# Altium schematic sheet PULSE.SchDoc
size A4
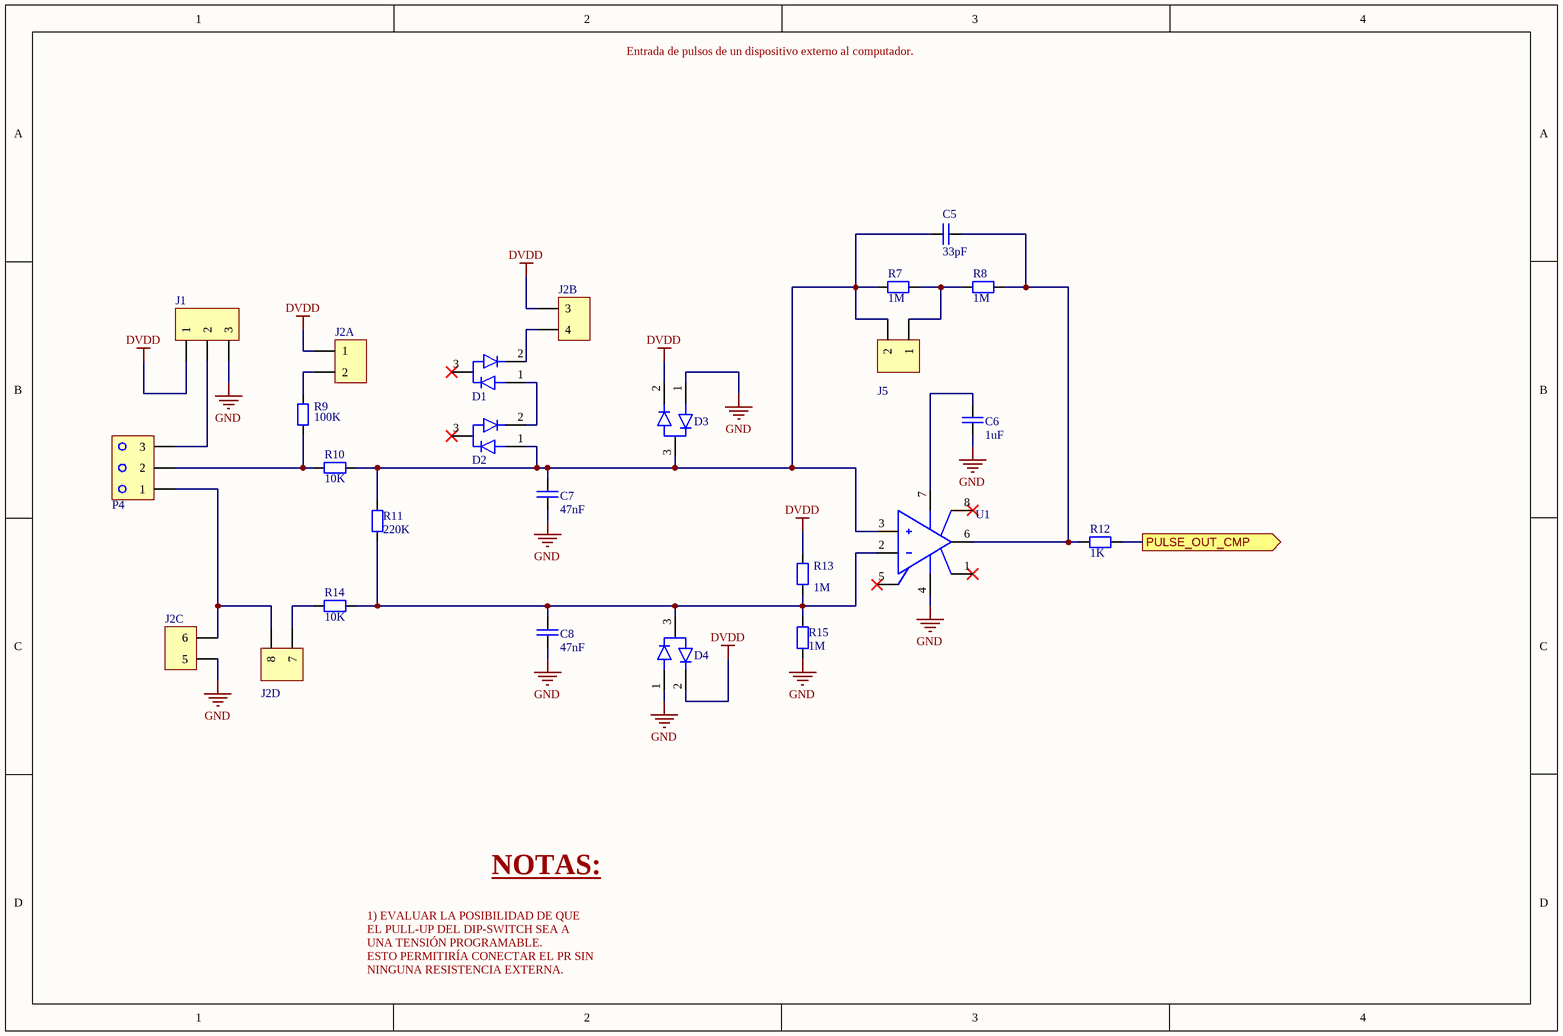
[diagram p0: PULSE.SchDoc]

## Parts
C5  33pF  [CAP_SM0805_YAGEOCC2_N]
C6  1uF  [CAP_SM0805_YAGEOCC2_N]
C7  47nF  [CAP_SM0805_YAGEOCC2_N]
C8  47nF  [CAP_SM0805_YAGEOCC2_N]
D1  BAV23S  [BAV23S]  (value not drawn)
D2  BAV23S  [BAV23S]  (value not drawn)
D3  BAV23S  [BAV23S]  (value not drawn)
D4  BAV23S  [BAV23S]  (value not drawn)
J1  (no value)  [HEADER PIN 1X3]
J2  Usar equivalente  [HEADER PIN 2X4]  (value not drawn)  (parts A,B,C,D of 4)
J5  Usar Equivalente  [HEADER PIN 1X2]  (value not drawn)
P4  WJ15EDGVC-3.81-3P  [HEADER PLUG 3]  (value not drawn)
R7  1M  [RES_SM0805_YAGEORC_N]
R8  1M  [RES_SM0805_YAGEORC_N]
R9  100K  [RES_SM0805_YAGEORC_N]
R10  10K  [RES_SM0805_YAGEORC_N]
R11  220K  [RES_SM0805_YAGEORC_N]
R12  1K  [RES_SM0805_YAGEORC_N]
R13  1M  [RES_SM0805_YAGEORC_N]
R14  10K  [RES_SM0805_YAGEORC_N]
R15  1M  [RES_SM0805_YAGEORC_N]
U1  MCP6541  [MCP6541-E/SN]  (value not drawn)

## Ports
PULSE_OUT_CMP (out)

## Nets
DVDD: D3.2 D4.2 J1.1 J2.1 J2.3 R13.2
GND: C6.2 C7.2 C8.2 D3.1 D4.1 J1.3 J2.5 R15.1 U1.4(V-)
PULSE_OUT_CMP: R12.2 ; port PULSE_OUT_CMP
NetC5_1: C5.1 C7.1 D2.1 D3.3 J5.2 R7.1 R10.2 R11.2 U1.3(IN+)
NetC5_2: C5.2 R8.2 R12.1 U1.6(OUT)
NetC6_1: C6.1 U1.7(V+)
NetC8_1: C8.1 D4.3 R11.1 R13.1 R14.2 R15.2 U1.2(IN-)
NetD1_1: D1.1 D2.2
NetD1_2: D1.2 J2.4
NetJ1_2: J1.2 P4.3
NetJ2_2: J2.2 R9.2
NetJ2_6: J2.6 J2.8 P4.1
NetJ2_7: J2.7 R14.1
NetJ5_1: J5.1 R7.2 R8.1
NetP4_2: P4.2 R9.1 R10.1

Not connected (* = marked no-connect by the designer): D1 3*; D2 3*; U1 1(OS_NUL)* 5(OS_NUL)* 8(TAB)*

## Notes on the sheet
- Entrada de pulsos de un dispositivo externo al computador.
- NOTAS:
- 1) EVALUAR LA POSIBILIDAD DE QUE EL PULL-UP DEL DIP-SWITCH SEA A UNA TENSIÓN PROGRAMABLE.
  ESTO PERMITIRÍA CONECTAR EL PR SIN NINGUNA RESISTENCIA EXTERNA.
- Title:
- Size: A4
- Date:
- FMC-320U MODEL A
- Sheet:
- Time:
- Of:
- Version:
- Revision:
- Release:
- 1
- 0
- FLOWMEET SRL
- File

## Library data of the parts
C5 = CC0805JRNPO9BN330: CAP 33pF SM0805 NPO 50V YAGEO CC2; Tolerance (%): 5; Voltage Rating (Volts): 50; Category: Capacitor; Manufacturer: Yageo; Manufacturer Part Number: CC0805JRNPO9BN330; Package: 0805; Value: 33pF; Supplier Part Number 1: 1362559; Supplier 1: Farnell; ComponentLink1URL: http://www.yageo.com; ComponentLink1Description: Manufacturer Website; Supplier 2: Digi-Key; Supplier Part Number 2: 311-1105-1-ND
C6 = CC0805KKX7R8BB105: CAP 1uF SM0805 X7R 25V YAGEO CC2; Tolerance (%): 10; Voltage Rating (Volts): 25; Category: Capacitor; Manufacturer: Yageo; Manufacturer Part Number: CC0805KKX7R8BB105; Package: 0805; Value: 1uF; Supplier Part Number 1: 1458903; Supplier 1: Farnell; ComponentLink1URL: http://www.yageo.com; ComponentLink1Description: Manufacturer Website; Supplier 2: Digi-Key; Supplier Part Number 2: 311-1456-1-ND
C7 C8 = CC0805KRX7R8BB473: CAP 47nF SM0805 X7R 25V YAGEO CC2; Tolerance (%): 10; Voltage Rating (Volts): 25; Category: Capacitor; Manufacturer: Yageo; Manufacturer Part Number: CC0805KRX7R8BB473; Package: 0805; Value: 47nF; Supplier Part Number 1: 644201; Supplier 1: Farnell; ComponentLink1URL: http://www.yageo.com; ComponentLink1Description: Manufacturer Website; Supplier 2: Digi-Key
D1-D4 = BAV23S: DIODE ARRAY GP 250V 200MA SOT23; Manufacturer: onsemi; Manufacturer Part Number: BAV23S; Category: Diodo; Datasheet: https://www.onsemi.com/pdf/datasheet/bav23s-d.pdf
J1 = 54101-T0600LF-03: 1 x 3 - Cuttable - true hole  2.54mm - Pb free; Manufacturer: Amphenol ICC; Manufacturer Part Number: 54101-T06-00; Type: Thru-hole; Package: 2.54mm; ComponentLink1Description: Datasheet; ComponentLink1URL: https://datasheet.lcsc.com/lcsc/2202082130_Amphenol-ICC-54101-T06-00_C213463.pdf
J2 = 54102-T0604LF-JUMPER: 2 x 4  - true hole  2.54mm; Manufacturer: Amphenol ICC; Equivalente: PZ254V-12-8P; Category: Header pin; Datasheet: New link; Manufacturer PartNumber: 54102-T0604LF
J5 = 54101-T0602LF: 1 x 2 - true hole  2.54mm - Pb free; Manufacturer: Amphenol ICC; Equivalente: B-2100S02P-A110; Manufacturer Part Number: 54101-T0602LF; Category: Header pin; Datasheet: https://datasheet.lcsc.com/lcsc/2202082130_Amphenol-ICC-54101-T06-00_C213463.pdf
P4 = WJ15EDGVC-3.81-3P: TERM BLOK FEMALE 1X3 3.81MM; Manufacturer: Ningbo Kangnex Elec; Category: Bornera enchufable; Manufacturer Part Number: WJ15EDGVC-3.81-3P; Datasheet: https://datasheet.lcsc.com/lcsc/1912251632_Ningbo-Kangnex-Elec-WJ15EDGVC-3-81-3P_C8389.pdf
R7 R8 R13 R15 = RC0805FR-071ML: RES 1M SM0805 YAGEO RC_L; Power (Watts): 0.125; Resistance (Ohms): 1000000; Tolerance (%): 1; Category: Resistor; Manufacturer: Yageo; Manufacturer Part Number: RC0805FR-071ML; Package: 0805; Value: 1M; Supplier Part Number 1: 9237992; Supplier 1: Farnell; ComponentLink1URL: http://www.yageo.com; ComponentLink1Description: Manufacturer Website; Supplier 2: Digi-Key; Supplier Part Number 2: 311-1.00MCRCT-ND
R9 = RC0805FR-07100KL: RES 100K SM0805 YAGEO RC_L; Power (Watts): 0.125; Resistance (Ohms): 100000; Tolerance (%): 1; Category: Resistor; Manufacturer: Yageo; Manufacturer Part Number: RC0805FR-07100KL; Package: 0805; Value: 100K; Supplier Part Number 1: 9237879; Supplier 1: Farnell; ComponentLink1Description: Manufacturer Website; ComponentLink1URL: http://www.yageo.com; Supplier 2: Digi-Key; Supplier Part Number 2: 311-100KCRCT-ND
R10 R14 = RC0805FR-0710KL: RES 10K SM0805 YAGEO RC_L; Power (Watts): 0.125; Resistance (Ohms): 10000; Tolerance (%): 1; Category: Resistor; Manufacturer: Yageo; Manufacturer Part Number: RC0805FR-0710KL; Package: 0805; Value: 10K; Supplier Part Number 1: 9237755; Supplier 1: Farnell; ComponentLink1Description: Manufacturer Website; ComponentLink1URL: http://www.yageo.com; Supplier 2: Digi-Key; Supplier Part Number 2: 311-10.0KCRCT-ND
R11 = RC0805FR-07220KL: RES 220K SM0805 YAGEO RC_L; Power (Watts): 0.125; Resistance (Ohms): 220000; Tolerance (%): 1; Category: Resistor; Manufacturer: Yageo; Manufacturer Part Number: RC0805FR-07220KL; Package: 0805; Value: 220K; Supplier Part Number 1: 9237917; Supplier 1: Farnell; ComponentLink1Description: Manufacturer Website; ComponentLink1URL: http://www.yageo.com; Supplier 2: Digi-Key; Supplier Part Number 2: 311-220KCRCT-ND
R12 = RC0805FR-071KL: RES 1K SM0805 YAGEO RC_L; Power (Watts): 0.125; Resistance (Ohms): 1000; Tolerance (%): 1; Category: Resistor; Manufacturer: Yageo; Manufacturer Part Number: RC0805FR-071KL; Package: 0805; Value: 1K; Supplier Part Number 1: 9237496; Supplier 1: Farnell; ComponentLink1URL: http://www.yageo.com; ComponentLink1Description: Manufacturer Website; Supplier 2: Digi-Key; Supplier Part Number 2: 311-1.00KCRCT-ND
U1 = MCP6541-E/SN: IC COMP PP I/O SNGL 1.6V 8SOIC; Manufacturer: Microchip Tech; Manufacturer Part Number: MCP6541-E/SN; Category: Amplificador operacional; Datasheet: https://ww1.microchip.com/downloads/en/DeviceDoc/MCP6541%20Output%20SubMicroamp%20Comparators%2020001696K.pdf